# Altium schematic sheet POWER.SchDoc: {Наименование}
size 420 x 297 mm; ApprovedBy: {Утвердил}; CheckedBy: {Проверил}; DrawnBy: {Разраб.}; SheetNumber: 5; Scale: {Мш.}; PageSetup: Record=PageOptions|CenterHorizontal=False|CenterVertical=False|PrintScale=0.95|XCorrection=0.00|YCorrection=0.00|PrintKind=1|BorderSize=5000000|LeftOffset=0|BottomOffset=0|Orientation=1|PaperLength=1000|PaperWidth=1000|Scale=100|PaperSource=15|PrintQuality=600|MediaType=1|DitherType=10|PaperKind=A4|PrintScaleMode=1; ProcessInspection: {Т.контр.}; Mass: {М.}; NormInspection: {Н.контр.}; Letter1Column: {}; Letter2Column: {}; Letter3Column: {}; DocumentType: {Документ}; Rule: PcbType=ProtelPcb
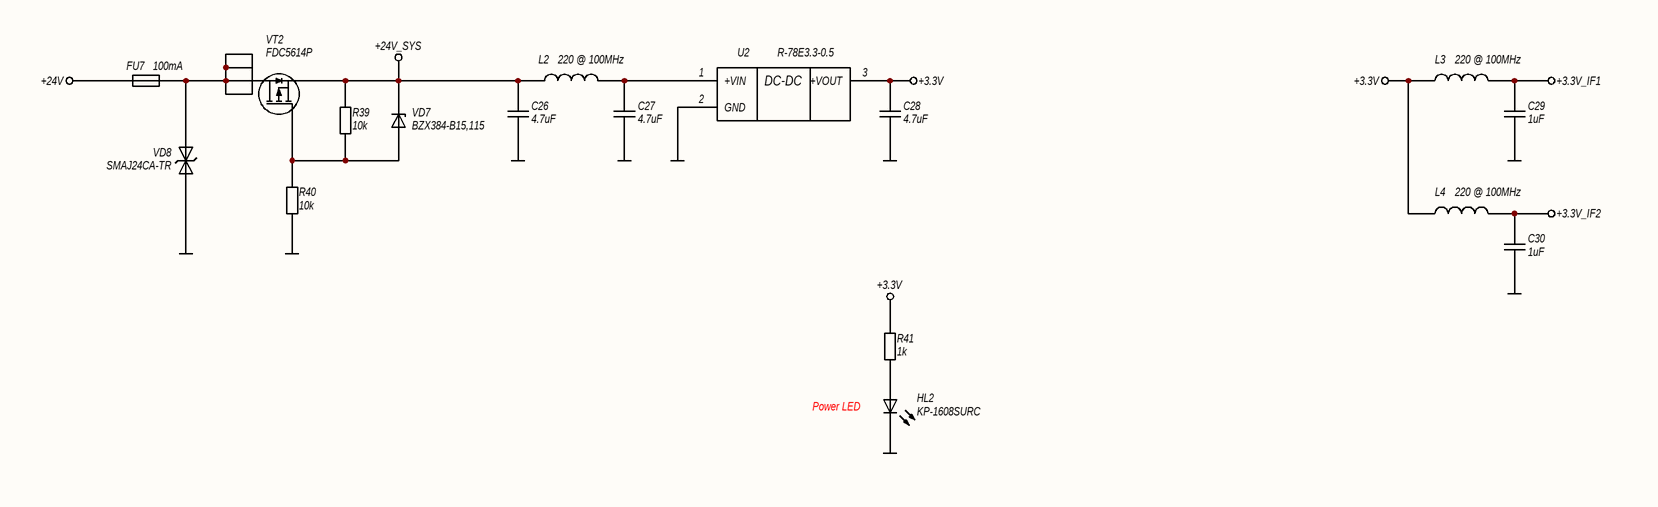
[diagram p0: POWER.SchDoc]

## Parts
C26  4.7uF  [C1206N]
C27  4.7uF  [C1206N]
C28  4.7uF  [C0805N]
C29  1uF  [C0603N]
C30  1uF  [C0603N]
FU7  100mA  [0ZCJ_0.85]
HL2  KP-1608SURC  [LED0603]
L2  220 @ 100MHz  [FB0603N]
L3  220 @ 100MHz  [FB0603N]
L4  220 @ 100MHz  [FB0603N]
R39  10k  [R0603N]
R40  10k  [R0603N]
R41  1k  [R0603N]
U2  R-78E3.3-0.5  [DC-DC_SIP3]
VD7  BZX384-B15,115  [SOD323]
VD8  SMAJ24CA-TR  [SMA]
VT2  FDC5614P  [TSOT23-6]

## Nets
+3.3V: C28.2 L3.1 L4.1 R41.1 U2.3(+VOUT)
+3.3V_IF1: C29.1 L3.2
+3.3V_IF2: C30.1 L4.2
+24V: FU7.2
+24V_SYS: C26.1 L2.1 R39.1 VD7.1(K) VT2.4(S)
GND: C26.2 C27.2 C28.1 C29.2 C30.2 HL2.1(K) R40.2 U2.2(GND) VD8.2(A2)
NetC27_1: C27.1 L2.2 U2.1(+VIN)
NetFU7_1: FU7.1 VD8.1(A1) VT2.1(D) VT2.2(D) VT2.5(D) VT2.6(D)
NetHL2_2: HL2.2(A) R41.2
NetR39_2: R39.2 R40.1 VD7.2(A) VT2.3(G)

## Notes on the sheet
- (near HL2) Power LED
- Перв. примен.
- Справ. №
- Подп. и дата
- Инв. № дубл.
- Взам. инв. №
- Изм.
- Лист
- № докум.
- Подп.
- Дата
- Т.контр.
- Пров.
- Разраб.
- Лит.
- Листов
- Инв. № подл.
- Н.контр.
- Утв.
- Копировал
- Формат А3
- (in symbol R-78E3.3-0.5) DC-DC

## Library data of the parts
C26 C27 = CC1206KKX7R9BB475: Конденсатор; Точность: 10%; Напряжение: 50V; Диэлектрик: X7R; Производитель: YAGEO; Описание: 4.7 µF ±10% 50V Ceramic Capacitor X7R 1206 (3216 Metric); Корпус: 1206 (3216 Metric); Строка для документации: ttps://www.yageo.com/upload/media/product/productsearch/datasheet/mlcc/UPY-NP0X7R_HV_1KV-to-3KV_13.pdf; Температурный диапазон: -55°C ~ 125°C; Вид монтажа: SMD; Артикул: CC1206KKX7R9BB475; Номинал: 4.7uF; Тип элемента: Конденсатор
C28 = CL21A475KAQNNNG: Конденсатор; Точность: 10%; Напряжение: 25V; Диэлектрик: X5R; Производитель: Samsung Electro-Mechanics; Описание: 4.7 µF ±10% 25V Ceramic Capacitor X5R 0805 (2012 Metric); Корпус: 0805 (2012 Metric); Температурный диапазон: -55°C ~ 85°C; Вид монтажа: SMD; Артикул: CL21A475KAQNNNG; Номинал: 4.7uF; Строка для документации: https://mm.digikey.com/Volume0/opasdata/d220001/medias/docus/41/CL21A475KAQNNNG_DS.pdf; Тип элемента: Конденсатор
C29 C30 = CC0603KRX7R9BB105: Конденсатор; Точность: 10%; Напряжение: 50V; Диэлектрик: X7R; Производитель: YAGEO; Описание: 1 µF ±10% 50V Ceramic Capacitor X7R 0603 (1608 Metric); Корпус: 0603 (1608 Metric); Температурный диапазон: -55°C ~ 125°C; Вид монтажа: SMD; Артикул: CC0603KRX7R9BB105; Номинал: 1uF; Строка для документации: https://www.yageo.com/upload/media/product/productsearch/datasheet/mlcc/UPY-GPHC_X7R_6.3V-to-250V_24.pdf; Тип элемента: Конденсатор
FU7 = 0ZCJ0010FF2E: Плавкий предохранитель; Напряжение: 60V; Тип: PTC Resettable Fuse; Производитель: Bel Fuse Inc.; Описание: Polymeric PTC Resettable Fuse 60V 100 mA Ih Surface Mount 1206 (3216 Metric), Concave; Корпус: 1206 (3216 Metric), Concave; Температурный диапазон: -40°C ~ 85°C; Вид монтажа: SMD; Артикул: 0ZCJ0010FF2E; Ток: 100mA; Строка для документации: https://www.belfuse.com/resources/datasheets/circuitprotection/ds-cp-0zcj-series.pdf; Тип элемента: Предохранитель
HL2 = KP-1608SURC: Светодиод; Прямой ток: 20mA; Напряжение: 2.5V; Яркость: 200mcd; Цвет: Красный; Длина волны: 628nm; Производитель: Kingbright; Описание: Red 628nm LED Indication - Discrete 2.5V 0603 (1608 Metric); Корпус: 0603 (1608 Metric); Температурный диапазон: -40°C ~ 80°C; Вид монтажа: SMD; Тип элемента: Диод светоизлучающий; Артикул: KP-1608SURC; Строка для документации: https://docs.rs-online.com/ec7c/0900766b8032f182.pdf
L2-L4 = BLM18PG221SN1D: Фильтр ЭМП индуктивный; Ток: 1.4A; Сопротивление: 100m; Тип: Ferrite Bead; Производитель: Murata Electronics; Описание: 220 Ohms @ 100 MHz 1 Power Line Ferrite Bead 0603 (1608 Metric) 1.4A 100mOhm; Корпус: 0603 (1608 Metric); Температурный диапазон: -55°C ~ 125°C; Вид монтажа: SMD; Артикул: BLM18PG221SN1D; Номинал: 220 @ 100MHz; Строка для документации: https://www.murata.com/en-us/products/productdata/8796738650142/ENFA0003.pdf; Тип элемента: Фильтр ЭМП
R39 R40 = RC0603FR-0710KL: Резистор; Точность: 1%; ТКС: ±100ppm/°C; Напряжение: 75V; Производитель: YAGEO; Описание: 10 kOhms ±1% 0.1W, 1/10W Chip Resistor 0603 (1608 Metric) Moisture Resistant Thick Film; Корпус: 0603 (1608 Metric); Температурный диапазон: -55°C ~ 155°C; Вид монтажа: SMD; Артикул: RC0603FR-0710KL; Номинал: 10k; Строка для документации: https://www.yageo.com/upload/media/product/app/datasheet/rchip/pyu-rc_group_51_rohs_l.pdf; Тип элемента: Резистор
R41 = RC0603FR-071KL: Резистор; Точность: 1%; ТКС: ±100ppm/°C; Напряжение: 75V; Производитель: YAGEO; Описание: 1 kOhms ±1% 0.1W, 1/10W Chip Resistor 0603 (1608 Metric) Moisture Resistant Thick Film; Корпус: 0603 (1608 Metric); Температурный диапазон: -55°C ~ 155°C; Вид монтажа: SMD; Артикул: RC0603FR-071KL; Номинал: 1k; Строка для документации: https://www.yageo.com/upload/media/product/app/datasheet/rchip/pyu-rc_group_51_rohs_l.pdf; Тип элемента: Резистор
U2 = R-78E3.3-0.5: Модуль неизолированного DC-DC конвертера; Описание: Linear Regulator Replacement DC DC Converter 1 Output 3.3V 500mA 6V - 28V Input; Тип: DC-DC Converter; Производитель: Recom Power; Температурный диапазон: -40°C ~ 85°C; Вид монтажа: Through Hole; Тип элемента: DC-DC преобразователь; Артикул: R-78E3.3-0.5; Строка для документации: https://recom-power.com/pdf/Innoline/R-78E-0.5.pdf
VD7 = BZX384-B15,115: Стабилитрон; Прямой ток: 5mA; Напряжение: 15V; Производитель: Nexperia USA Inc.; Описание: Zener Diode 15 V 300 mW ±2% Surface Mount SOD-323; Корпус: SOD-323; Температурный диапазон: -65°C ~ 150°C; Вид монтажа: SMD; Тип элемента: Диод; Артикул: BZX384-B15,115; Тип: Zener; Строка для документации: https://assets.nexperia.com/documents/data-sheet/BZX384_SER.pdf
VD8 = SMAJ24CA-TR: TVS диод двунаправленный; Напряжение: 24V; Напряжение ограничения: 50V; Напряжение пробоя: 26.7V; Ток: 46A; Тип: TVS Bidirectional; Производитель: STMicroelectronics; Описание: 50V Clamp 46A (8/20µs) Ipp Tvs Diode Surface Mount DO-214AC (SMA); Корпус: DO-214AC, SMA; Температурный диапазон: -55°C ~ 150°C (TJ); Вид монтажа: SMD; Тип элемента: Диод защитный; Артикул: SMAJ24CA-TR; Строка для документации: https://www.st.com/resource/en/datasheet/cd00001333.pdf
VT2 = FDC5614P: МОП транзистор, P-канальный; Ток: -3A (Ta); Напряжение: -60V; Сопротивление канала: 105m; Пороговое напряжение: -3V; Тип: P-MOSFET; Производитель: onsemi; Описание: P-Channel 60 V 3A (Ta) 1.6W (Ta) Surface Mount SuperSOT™-6; Корпус: TSOT-23-6; Температурный диапазон: -55°C ~ 150°C (TJ); Вид монтажа: SMD; Тип элемента: Транзистор полевой; Артикул: FDC5614P; Строка для документации: https://www.onsemi.com/pdf/datasheet/fdc5614p-d.pdf